# EAGLE design Gateway (EAGLE 9.2.0)
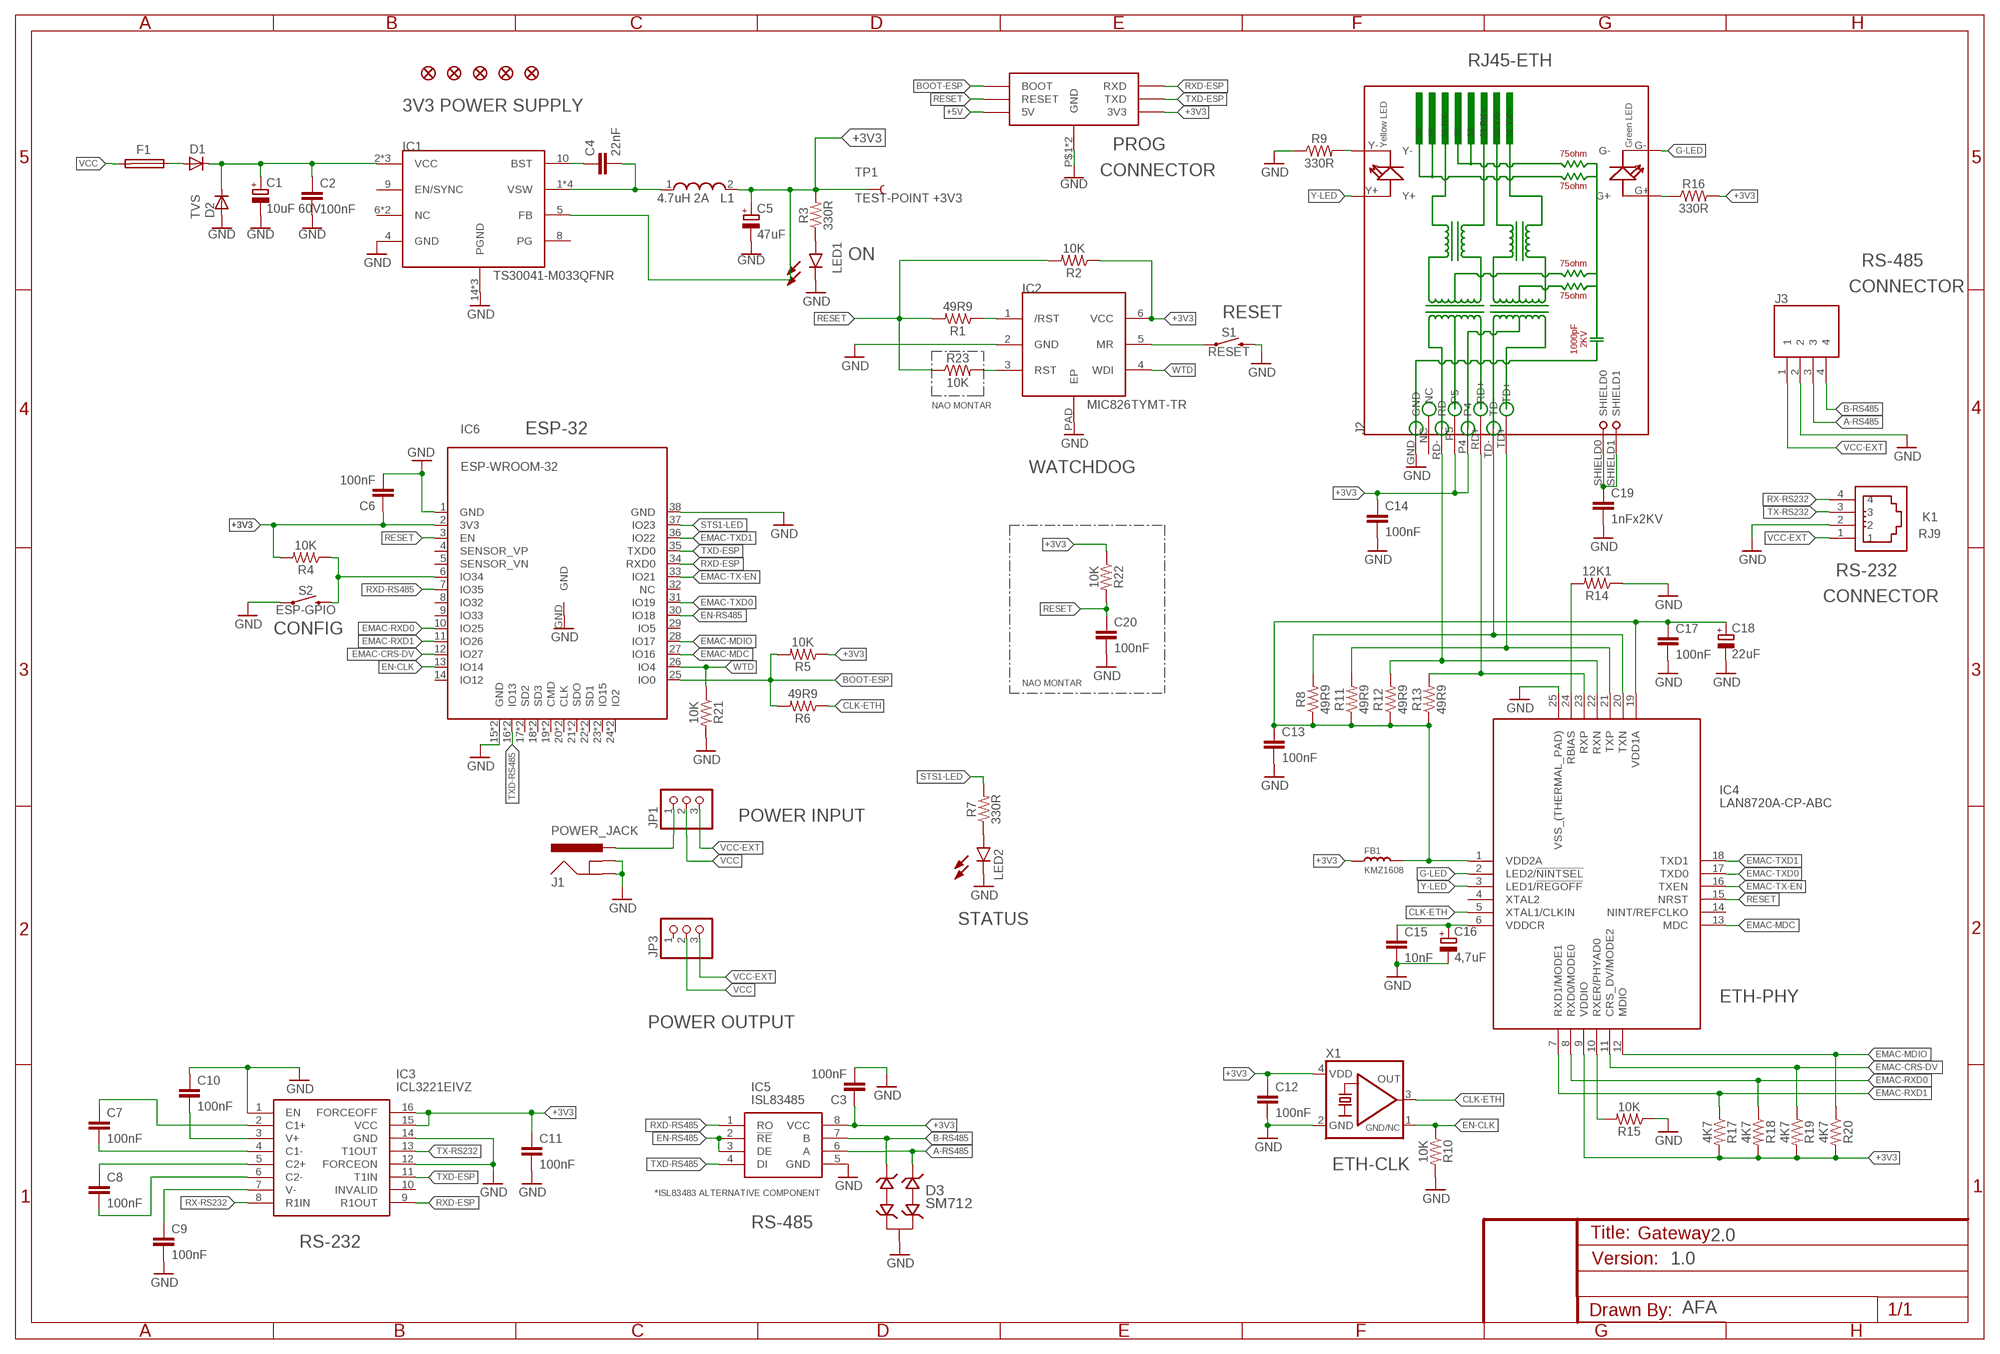
[diagram p0: schematic, sheet 1]
FRAME1 (FRAME-A3): SPICEPREFIX: X

## Parts
C1  10uF 60V  CPOL-EUUD-6,3X7,7  [UD-6,3X7,7_NICHICON]
C2  100nF  1.5PF-0603-50V-16.667%  [0603]
C3  100nF  1.5PF-0603-50V-16.667%  [0603]
C4  22nF  1.5PF-0603-50V-16.667%  [0603]
C5  47uF  CPOL-EUUD-6,3X7,7  [UD-6,3X7,7_NICHICON]
C6  100nF  1.5PF-0603-50V-16.667%  [0603]
C7  100nF  1.5PF-0603-50V-16.667%  [0603]
C8  100nF  1.5PF-0603-50V-16.667%  [0603]
C9  100nF  1.5PF-0603-50V-16.667%  [0603]
C10  100nF  1.5PF-0603-50V-16.667%  [0603]
C11  100nF  1.5PF-0603-50V-16.667%  [0603]
C12  100nF  1.5PF-0603-50V-16.667%  [0603]
C13  100nF  1.5PF-0603-50V-16.667%  [0603]
C14  100nF  1.5PF-0603-50V-16.667%  [0603]
C15  10nF  1.5PF-0603-50V-16.667%  [0603]
C16  4,7uF  CPOL-EUUD-6,3X7,7  [UD-6,3X7,7_NICHICON]
C17  100nF  1.5PF-0603-50V-16.667%  [0603]
C18  22uF  CPOL-EUUD-6,3X7,7  [UD-6,3X7,7_NICHICON]
C19  1nFx2KV  CAP1206  [1206]
C20  100nF  1.5PF-0603-50V-16.667%  [0603]
D1  DIODE-SMB  [SMB]
D2  DIODE-SMB  [SMB]
D3  SM712  CDSOT23-SM712  [SOT-23-3]
F1  FUSE_0679L  [FUSE_0679L]
FB1  KMZ1608  SMD-FERRITE-BEAD-120R-2A(0603)  [L0603]
FD1  FIDUCIAL1X2  [FIDUCIAL-1X2]
FD2  FIDUCIAL1X2  [FIDUCIAL-1X2]
FD3  FIDUCIAL1X2  [FIDUCIAL-1X2]
FD4  FIDUCIAL1X2  [FIDUCIAL-1X2]
FD5  FIDUCIAL1X2  [FIDUCIAL-1X2]
IC1  TS30041-M033QFNR  TS30041-M  [QFN50P300X300X100-17N]
IC2  MIC826TYMT-TR  MIC826RYMT  [DFN-6]
IC3  ICL3221EIVZ  [SOP65P640X120-16N]
IC4  LAN8720A-CP-ABC  [QFN50P400X400X100-25N]
IC5  ISL83485  MAX485CSA+  [SOIC127P600X175-8N]
IC6  ESP-WROOM-32  [ESP-WROOM-32]
J1  POWER_JACK  [POWER_JACK_PTH]
J2  RJ45-HR911105A-HR911105A  [RJ45]
J3  1757268  [SHDR4W120P0X508_1X4_2224X1200X]
JP1  PINHD-1X3  [1X03]
JP3  PINHD-1X3  [1X03]
K1  RJ9  615004143821  [615004143821]
L1  4.7uH 2A  NRS5020T220MMGJ  [INDM4949X200N]
LED1  LTST-S220GKT  [LTST-S220KFKT]
LED2  LTST-S220GKT  [LTST-S220KFKT]
R1  49R9  0.27OHM-0603-1/10W-1%  [0603]
R2  10K  0.27OHM-0603-1/10W-1%  [0603]
R3  330R  0.27OHM-0603-1/10W-1%  [0603]
R4  10K  0.27OHM-0603-1/10W-1%  [0603]
R5  10K  0.27OHM-0603-1/10W-1%  [0603]
R6  49R9  0.27OHM-0603-1/10W-1%  [0603]
R7  330R  0.27OHM-0603-1/10W-1%  [0603]
R8  49R9  0.27OHM-0603-1/10W-1%  [0603]
R9  330R  0.27OHM-0603-1/10W-1%  [0603]
R10  10K  0.27OHM-0603-1/10W-1%  [0603]
R11  49R9  0.27OHM-0603-1/10W-1%  [0603]
R12  49R9  0.27OHM-0603-1/10W-1%  [0603]
R13  49R9  0.27OHM-0603-1/10W-1%  [0603]
R14  12K1  0.27OHM-0603-1/10W-1%  [0603]
R15  10K  0.27OHM-0603-1/10W-1%  [0603]
R16  330R  0.27OHM-0603-1/10W-1%  [0603]
R17  4K7  0.27OHM-0603-1/10W-1%  [0603]
R18  4K7  0.27OHM-0603-1/10W-1%  [0603]
R19  4K7  0.27OHM-0603-1/10W-1%  [0603]
R20  4K7  0.27OHM-0603-1/10W-1%  [0603]
R21  10K  0.27OHM-0603-1/10W-1%  [0603]
R22  10K  0.27OHM-0603-1/10W-1%  [0603]
R23  10K  0.27OHM-0603-1/10W-1%  [0603]
S1  RESET  MOMENTARY-SWITCH-SPST-PTH-RIGHT-ANGLE-KIT  [TACTILE_SWITCH_PTH_RIGHT_ANGLE_KIT]
S2  ESP-GPIO  MOMENTARY-SWITCH-SPST-PTH-RIGHT-ANGLE-KIT  [TACTILE_SWITCH_PTH_RIGHT_ANGLE_KIT]
TP1  TEST-POINT +3V3  TEST-POINT3X5  [PAD.03X.05]
U$4  ESP-PROGESPROG-4  [ESPROG-4]
X1  KXO-TCXO-CMOS-82  [7.0X5.0_KXO-82-TCXO]

## Nets
+3V3: C3.1 C5.+ C6.1 C11.1 C12.1 C14.1 FB1.1 IC1.5(FB) IC2.6(VCC) IC3.15(VCC) IC3.16(FORCEOFF) IC4.9(VDDIO) IC5.8(VCC) IC6.2(3V3) J2.P4 J2.P5 L1.2 R2.1 R3.2 R4.2 R5.1 R16.2 R17.2 R18.2 R19.2 R20.2 R22.1 TP1.P$1 U$4.3V3 X1.4(VDD)
+5V: U$4.5V0(5V)
A-RS485: D3.2(IO2) IC5.6(A) J3.3
B-RS485: D3.1(IO1) IC5.7(B) J3.4
BOOT-ESP: IC6.25(IO0) R5.2 R6.2 U$4.BOOT
CLK-ETH: IC4.5(XTAL1/CLKIN) R6.1 X1.3(OUT)
EMAC-CRS-DV: IC4.11(CRS_DV/MODE2) IC6.12(IO27) R19.1
EMAC-MDC: IC4.13(MDC) IC6.27(IO16)
EMAC-MDIO: IC4.12(MDIO) IC6.28(IO17) R20.1
EMAC-RXD0: IC4.8(RXD0/MODE0) IC6.10(IO25) R18.1
EMAC-RXD1: IC4.7(RXD1/MODE1) IC6.11(IO26) R17.1
EMAC-TX-EN: IC4.16(TXEN) IC6.33(IO21)
EMAC-TXD0: IC4.17(TXD0) IC6.31(IO19)
EMAC-TXD1: IC4.18(TXD1) IC6.36(IO22)
EN-CLK: IC6.13(IO14) R10.1 X1.1(GND/NC)
EN-RS485: IC5.2(!RE) IC5.3(DE) IC6.30(IO18)
G-LED: IC4.2(LED2/!NINTSEL) J2.G-
GND: C1.- C2.2 C3.2 C5.- C6.2 C9.2 C10.1 C11.2 C12.2 C13.2 C14.2 C15.2 C16.- C17.2 C18.- C19.2 C20.2 D2.A D3.3(GND) IC1.4(GND) IC1.14(PGND) IC1.15(PGND) IC1.17(PGND) IC2.2(GND) IC2.PAD(EP) IC3.1(EN) IC3.12(FORCEON) IC3.14(GND) IC4.25(VSS_(THERMAL_PAD)) IC5.5(GND) IC6.1(GND) IC6.15(GND) IC6.38(GND) IC6.39(GND) IC6.GND J1.GND J1.GNDBREAK J2.GND J3.2 K1.2 LED1.2(K) LED2.2(K) R9.1 R10.2 R14.1 R15.1 R21.2 S1.2 S2.1 U$4.P$1(GND) U$4.P$8(GND) X1.2(GND)
N$1: IC2.5(MR) S1.1
N$2: C7.1 IC3.2(C1+)
N$3: C7.2 IC3.4(C1-)
N$4: IC6.6(IO34) R4.1 S2.2
N$5: C8.1 IC3.5(C2+)
N$6: D1.A F1.1
N$7: C8.2 IC3.6(C2-)
N$8: C10.2 IC3.3(V+)
N$9: C9.1 IC3.7(V-)
N$10: J1.PWR JP1.1
N$11: LED1.1(A) R3.1
N$12: C4.1 IC1.10(BST)
N$13: C13.1 C17.1 C18.+ FB1.2 IC4.1(VDD2A) IC4.19(VDD1A) R8.1 R11.1 R12.1 R13.1
N$15: C19.1 J2.SHIELD0 J2.SHIELD1
N$16: IC2.3(RST) R23.2
N$17: IC2.1(/RST) R1.1
N$18: C4.2 IC1.1(VSW) IC1.12(VSW) IC1.13(VSW) IC1.16(VSW) L1.1
N$24: LED2.1(A) R7.1
N$28: J2.G+ R16.1
N$30: IC4.23(RXP) J2.RD+ R13.2
N$31: IC4.22(RXN) J2.RD- R12.2
N$33: IC4.21(TXP) J2.TD+ R11.2
N$34: J2.Y- R9.2
N$35: IC4.20(TXN) J2.TD- R8.2
N$36: C15.1 C16.+ IC4.6(VDDCR)
N$37: IC4.24(RBIAS) R14.2
N$38: IC4.10(RXER/PHYAD0) R15.2
POWER: C1.+ C2.1 D1.C D2.C IC1.2(VCC) IC1.3(VCC) IC1.11(VCC)
RESET: C20.1 IC4.15(NRST) IC6.3(EN) R1.2 R2.2 R22.2 R23.1 U$4.RESET
RX-RS232: IC3.8(R1IN) K1.4
RXD-ESP: IC3.9(R1OUT) IC6.34(RXD0) U$4.RXD
RXD-RS485: IC5.1(RO) IC6.7(IO35)
STS1-LED: IC6.37(IO23) R7.2
TX-RS232: IC3.13(T1OUT) K1.3
TXD-ESP: IC3.11(T1IN) IC6.35(TXD0) U$4.TXD
TXD-RS485: IC5.4(DI) IC6.16(IO13) IC6.40(IO13)
VCC: F1.2 JP1.2 JP3.2
VCC-EXT: J3.1 JP1.3 JP3.3 K1.1
WTD: IC2.4(WDI) IC6.26(IO4) R21.1
Y-LED: IC4.3(LED1/!REGOFF) J2.Y+
Unconnected: IC1.6(NC) IC1.7(NC) IC1.8(PG) IC1.9(EN/SYNC) IC3.10(INVALID) IC4.4(XTAL2) IC4.14(NINT/REFCLKO) IC6.4(SENSOR_VP) IC6.5(SENSOR_VN) IC6.8(IO32) IC6.9(IO33) IC6.14(IO12) IC6.17(SD2) IC6.18(SD3) IC6.19(CMD) IC6.20(CLK) IC6.21(SDO) IC6.22(SD1) IC6.23(IO15) IC6.24(IO2) IC6.29(IO5) IC6.32(NC) IC6.41(SD2) IC6.42(SD3) IC6.43(CMD) IC6.44(IO2) IC6.45(IO15) IC6.46(SD1) IC6.47(SDO) IC6.48(CLK) J2.NC JP3.1

## Notes on the sheet
- RJ45-ETH
- 3V3 POWER SUPPLY
- PROG
- CONNECTOR
- TVS
- ON
- RS-485
- CONNECTOR
- RESET
- NAO MONTAR
- ESP-32
- WATCHDOG
- RS-232
- CONNECTOR
- CONFIG
- NAO MONTAR
- POWER INPUT
- STATUS
- ETH-PHY
- POWER OUTPUT
- ETH-CLK
- *ISL83483 ALTERNATIVE COMPONENT
- RS-485
- 2.0
- RS-232
- 1.0
- AFA

## Library data of the parts
C1 C5 C16 C18 = rcl:CPOL-EU: POLARIZED CAPACITOR, European symbol; SPICEPREFIX: C
C2-C4 C6-C15 C17 C20 = SparkFun-Capacitors:1.5PF: 1.5pF ceramic capacitors A capacitor is a passive two-terminal electrical component used to store electrical energy temporarily in an electric field.; PROD_ID: CAP-08763; VALUE: 1.5pF
C19 = PatternAgents-ProtoPads:CAP: Capacitor Standard 0603 ceramic capacitor, and 0.1" leaded capacitor.
D1 D2 = diode:DIODE-: DIODE
D3 = CDSOT23-SM712:CDSOT23-SM712: Bourns CDSOT23-SM712 http://www.bourns.com/docs/Product-Datasheets/CDSOT23-SM712.pdf TVS Protection Didoe for RS-485 as recommended by TI in their RS-485 Reference Guide: http://www.ti.com/lit/sg/slyt484a/slyt484a.pdf; AVAILABILITY: Good; DESCRIPTION: Diode, Smt Tvs Array, 7vrwm & 12vrwm, Sot23 Package; MF: Bourns; MP: CDSOT23-SM712; PACKAGE: SOT-23 Bourns; PRICE: 0.89 USD
F1 = Fuse_0679L:FUSE_0679L
FB1 = Seeed-OPL-Inductor:SMD-FERRITE-BEAD-120R-2A(0603): 303030024; MPN: BLM18PG121SN1D; VALUE: 120R 2A
FD1-FD5 = SparkFun-Aesthetics:FIDUCIAL: Fiducial Alignment Points Point-of-reference for pick-and-place machines and other optical instruments.
IC1 = IoTMakers:TS30041-M
IC2 = IoTMakers:MIC826RYMT
IC3 = SamacSys:ICL3221EIVZ: Intersil ICL3221EIVZ, Line Transceiver, EIA/TIA-232/ RS-232/ V.24/ V.28, 3.3 V, 5 V, 16-Pin TSSOP Source: Datasheet <http://www.intersil.com/content/dam/Intersil/documents/icl3/icl3221e-22e-23e-32e-41e-43e.pdf>; ARROW_PART_NUMBER: ICL3221EIVZ; ARROW_PRICE-STOCK: https://www.arrow.com/en/products/icl3221eivz/intersil; DESCRIPTION: Intersil ICL3221EIVZ, Line Transceiver, EIA/TIA-232/ RS-232/ V.24/ V.28, 3.3 V, 5 V, 16-Pin TSSOP; HEIGHT: 1.2mm; MANUFACTURER_NAME: Intersil; MANUFACTURER_PART_NUMBER: ICL3221EIVZ; RS_PART_NUMBER: 1708213; RS_PRICE-STOCK: http://uk.rs-online.com/web/p/products/1708213
IC4 = LAN8720A-CP-ABC:LAN8720A-CP-ABC: Ethernet ICs Small Footprint RMII RMII 10/100 Ethernet Source: Datasheet <http://ww1.microchip.com/downloads/en/DeviceDoc/00002165B.pdf>; ARROW_PART_NUMBER: LAN8720A-CP-ABC; ARROW_PRICE/STOCK: https://www.arrow.com/en/products/lan8720a-cp-abc/microchip-technology; DESCRIPTION: Ethernet ICs Small Footprint RMII RMII 10/100 Ethernet; HEIGHT: 1mm; MANUFACTURER_NAME: Microchip; MANUFACTURER_PART_NUMBER: LAN8720A-CP-ABC
IC5 = MAX485CSA+:MAX485CSA+: MAX485CSA+, Line Transceiver, RS-485, RS-422 2.5Mbit/s Differential, 5V, 8-Pin SOIC Source: Datasheet <http://datasheets.maximintegrated.com/en/ds/MAX1487-MAX491.pdf>; ARROW_PART_NUMBER: MAX485CSA+; ARROW_PRICE/STOCK: http://uk.rs-online.com/web/p/products/1659123; DESCRIPTION: MAX485CSA+, Line Transceiver, RS-485, RS-422 2.5Mbit/s Differential, 5V, 8-Pin SOIC; HEIGHT: 1.75mm; MANUFACTURER_NAME: Maxim Integrated; MANUFACTURER_PART_NUMBER: MAX485CSA+; RS_PART_NUMBER: 1659123; RS_PRICE/STOCK: http://uk.rs-online.com/web/p/products/1659123
IC6 = esp32:ESP-WROOM-32
J1 = SparkFun-Connectors:POWER_JACK: Power Jack Connector This is the standard 5.5mm barrel jack for power. The PTH is the most common, proven, reliable, footprint. The Slot footprint only works if the mill layer is transmitted to the PCB fab house so be warned. Here are the connectors we sell at SparkFun: DC Barrel Power Jack/Connector <https://www.sparkfun.com/products/119> (PRT-00119) DC Barrel Power Jack/Connector (SMD) <https://www.sparkfun.com/products/12748> (PRT-12748) DC Barrel Jack Adapter - Breadboard Compatible <https://www.sparkfun.com/products/10811> (PRT-10811) It is used on this SparkFun product (and many, many others): SparkFun RedBoard - Programmed with Arduino <https://www.sparkfun.com/products/12757> (DEV-12757) Also, if you need a mating power supply or connector, please check these out: Wall Adapter Power Supply - 9VDC 650mA <https://www.sparkfun.com/products/298> (TOL-00298) DC Barrel Jack Adapter - Male <https://www.sparkfun.com/products/10287> (PRT-10287); PROD_ID: CONN-08197
J2 = Connector:RJ45-HR911105A
J3 = 1757268:1757268: Pluggable Terminal Blocks 4 Pos 5.08mm pitch Through Hole Header Source: Datasheet <http://uk.rs-online.com/web/p/products/1896127>; ALLIED_NUMBER: 70054631; DESCRIPTION: Pluggable Terminal Blocks 4 Pos 5.08mm pitch Through Hole Header; HEIGHT: 8.6mm; MANUFACTURER_NAME: Phoenix Contact; MANUFACTURER_PART_NUMBER: 1757268; RS_PART_NUMBER: 1896127
JP1 JP3 = pinhead:PINHD-1X3: PIN HEADER
K1 = Wurth_Elektronik_Electromechanic_Input-Output_Connectors_rev15c:615004143821: WR-MJ Horizontal Plastic 4P4C Modular Jack Tab Up, 4 Pins=>Code : Con_I-O_MJ-H_Plastic_Up_615004143821 <http://katalog.we-online.de/media/images/eican/Con_I-O_MJ-H_Plastic_Up_615004143821_pf2.jpg> Details see: http://katalog.we-online.de/en/em/615_004_143_821 Created 2014-07-10, Karrer Zheng 2014 (C) Würth Elektronik
L1 = IoTMakers:NRS5020T220MMGJ: Inductor Power Shielded Wirewound 22uH 20% 100KHz Ferrite 1A 312mOhm DCR T/R; AVAILABILITY: Unavailable; DESCRIPTION: Inductor Power Shielded Wirewound 22uH 20% 100KHz Ferrite 1A 312mOhm DCR T/R; MF: Taiyo Yuden; MP: NRS5020T220MMGJ; PACKAGE: Nonstandard Taiyo Yuden; PRICE: None
LED1 LED2 = LTST-S220GKT:LTST-S220GKT: Lite-On LTST-S220GKT Green LED, 569 nm, 2012 (0805) Side View, Rectangle Lens SMD Package Source: Datasheet <http://www.arrow.com/en/products/ltst-s220gkt/lite-on-electronics>; ARROW_PART_NUMBER: LTST-S220GKT; DESCRIPTION: Lite-On LTST-S220GKT Green LED, 569 nm, 2012 (0805) Side View, Rectangle Lens SMD Package; HEIGHT: mm; MANUFACTURER_NAME: Lite-On; MANUFACTURER_PART_NUMBER: LTST-S220GKT
R1-R23 = SparkFun-Resistors:0.27OHM: 0.27Ω resistor A resistor is a passive two-terminal electrical component that implements electrical resistance as a circuit element. Resistors act to reduce current flow, and, at the same time, act to lower voltage levels within circuits. - Wikipedia; PROD_ID: RES-08787; VALUE: 0.27
S1 S2 = SparkFun-Switches:MOMENTARY-SWITCH-SPST: Momentary Switch (Pushbutton) - SPST Normally-open (NO) SPST momentary switches (buttons, pushbuttons). Variants PTH-12MM - 12mm square, through-hole Momentary Pushbutton Switch - 12mm Square <https://www.sparkfun.com/products/9190> (COM-09190) PTH-6.0MM, PTH-6.0MM-KIT - 6.0mm square, through-hole Mini Pushbutton Switch <https://www.sparkfun.com/products/97> (COM-00097) KIT package intended for soldering kit's - only one side of pads' copper is exposed. PTH-RIGHT-ANGLE-KIT - Right-angle, through-hole Right Angle Tactile Button <https://www.sparkfun.com/products/10791> - Used on SparkFun BigTime Watch Kit <https://www.sparkfun.com/products/11734> SMD-12MM - 12mm square, surface-mount Tactile Button - SMD (12mm) <https://www.sparkfun.com/products/12993> (COM-12993) Used on SparkFun PicoBoard <https://www.sparkfun.com/products/11888> SMD-4.5MM - 4.5mm Square Trackball Switch Used on SparkFun Blackberry Trackballer Breakout <https://www.sparkfun.com/products/13169> SMD-4.6MMX2.8MM - 4.60mm x 2.80mm, surface mount Used on SparkFun SAMD21 Mini Breakout <https://www.sparkfun.com/products/13664> SMD-5.2MM, SMD-5.2-REDUNDANT - 5.2mm square, surface-mount Mini Pushbutton Switch - SMD <https://www.sparkfun.com/products/8720> (COM-08720) Used on Arduino Pro Mini <https://www.sparkfun.com/products/11114> REDUNDANT package connects both switch circuits together SMD-6.0X3.5MM - 6.0 x 3.5mm, surface mount Momentary Reset Switch SMD <https://www.sparkfun.com/products/8229> (COM-08229) SMD-6.2MM-TALL - 6.2mm square, surface mount Tactile Button - SMD (6mm) <https://www.sparkfun.com/products/12992> Used on SparkFun Digital Sandbox <https://www.sparkfun.com/products/12651> SMD-RIGHT-ANGLE - Right-angle, surface mount Used on SparkFun Block for Intel® Edison - Arduino <https://www.sparkfun.com/products/13036>; PROD_ID: CONN-10672; SF_SKU: COM-10791
TP1 = SparkFun-Connectors:TEST-POINT: SparkFun Test Points Bare copper test points for troubleshooting or In-Circuit-Testing. These are used by our Production team for verifying production board runs using pogo-pins on test beds. SparkFun Products: SparkFun LSM9DS1 Breakout <https://www.sparkfun.com/products/13284> SparkFun PSOC <https://www.sparkfun.com/products/13714> SparkFun Load Cell Amplifier <https://www.sparkfun.com/products/13879>
U$4 = IoTMakers:ESP-PROG
X1 = crystal-geyer_V1_0:KXO-TCXO-CMOS: TCXO : CMOS - Serie Model Size l/w/h [mm] Frequency Range Frequency Stability Temp. Range [°C] Output AECQ 200 availabel Datasheet KXO-86 KXO-84 KXO-83 KXO-82 2.5/2.0/0.7 3.2/2.5/1.0 5.0/3.2/1.5 7.0/5.0/2.4 13,0 ~ 40,0 MHz 10,0 ~ 40,0 MHz 10,0 ~ 40,0 MHz 10,0 ~ 30,0 MHz ±1,0 … ±2,5ppm ±1,0 … ±2,5ppm ±1,0 … ±3,0ppm ±1,0 … ±3,0ppm (*) -30°C …+75°C (*) -40°C …+85°C (*) -40°C …+85°C (*) -30°C …+80°C CMOS CMOS CMOS CMOS - - - - KXO-86.pdf <http://www.geyer-electronic.de/uploads/tx_userartikelfrequenz/GEYER-KXO-86-TCXO-HCMOS.pdf> KXO-84.pdf <http://www.geyer-electronic.de/uploads/tx_userartikelfrequenz/GEYER-KXO-84-TCXO-HCMOS.pdf> KXO-83.pdf <http://www.geyer-electronic.de/uploads/tx_userartikelfrequenz/GEYER-KXO-83-TCXO-HCMOS.pdf> KXO-82.pdf <http://www.geyer-electronic.de/uploads/tx_userartikelfrequenz/GEYER-KXO-82-TCXO-HCMOS.pdf> <http://www.geyer-electronic.de/fileadmin/template/img/logo-geyer-electronic.png> Details see: http://www.geyer-electronic.de/Frequenz-Produkte.9.0.html Created 2016-06-07, Hans Locher 2016 (C) Geyer Quartz Technology KXO86,KXO84,KXO83,KXO82;2550;3225;5032;7050;2,5x2,0;3,2x2,5;2.5x2.0;3.2x2.5,5,0x3,2;7,0x5,0,5.0x3.2,7.0x5.0

## Net classes
0 default: clearance 0.205 mm

## Board
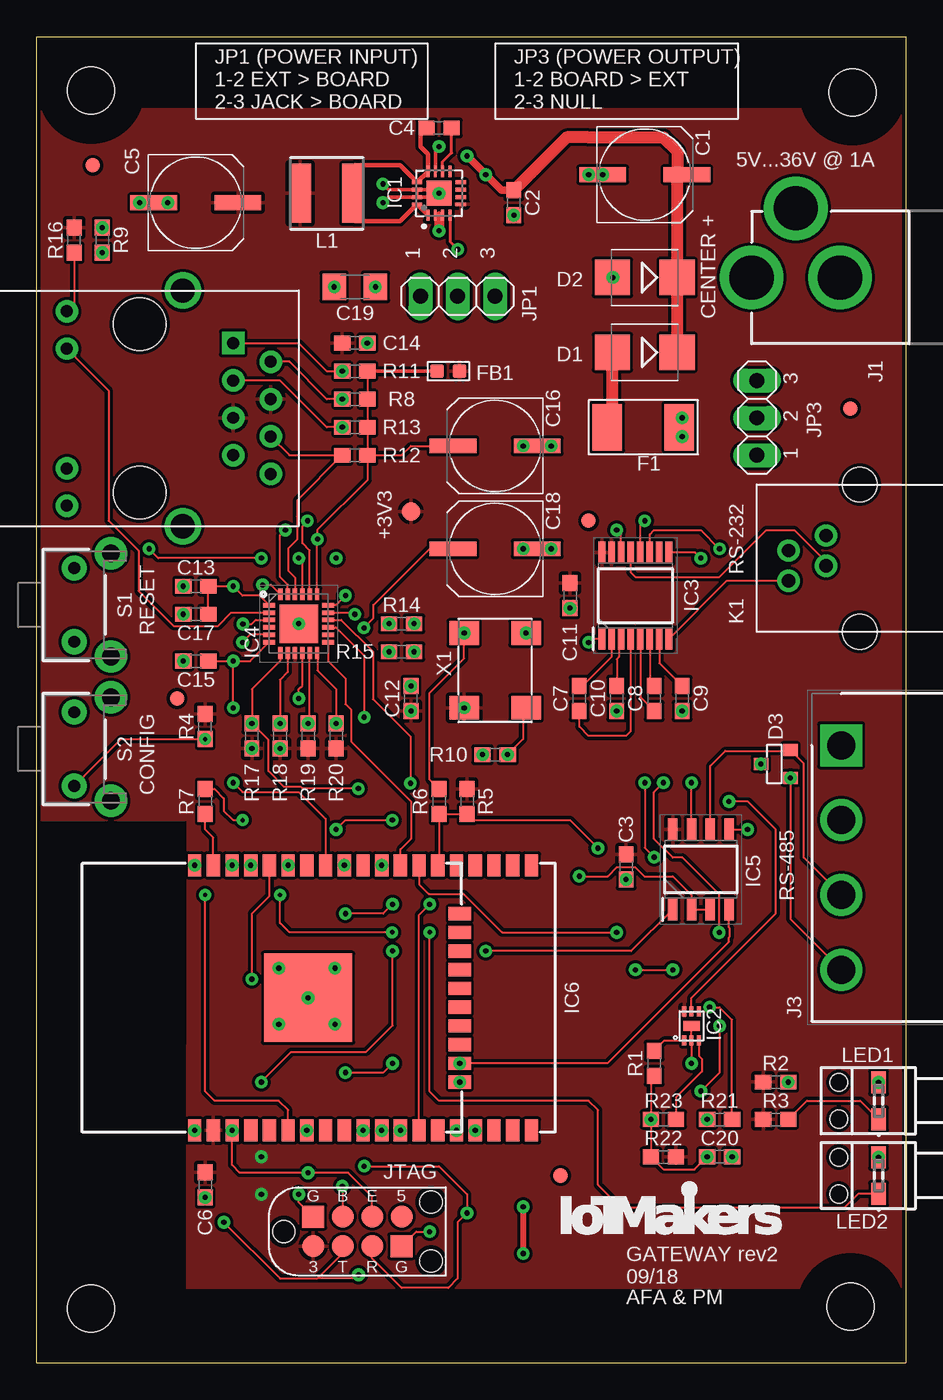
[diagram p1: board, top side]
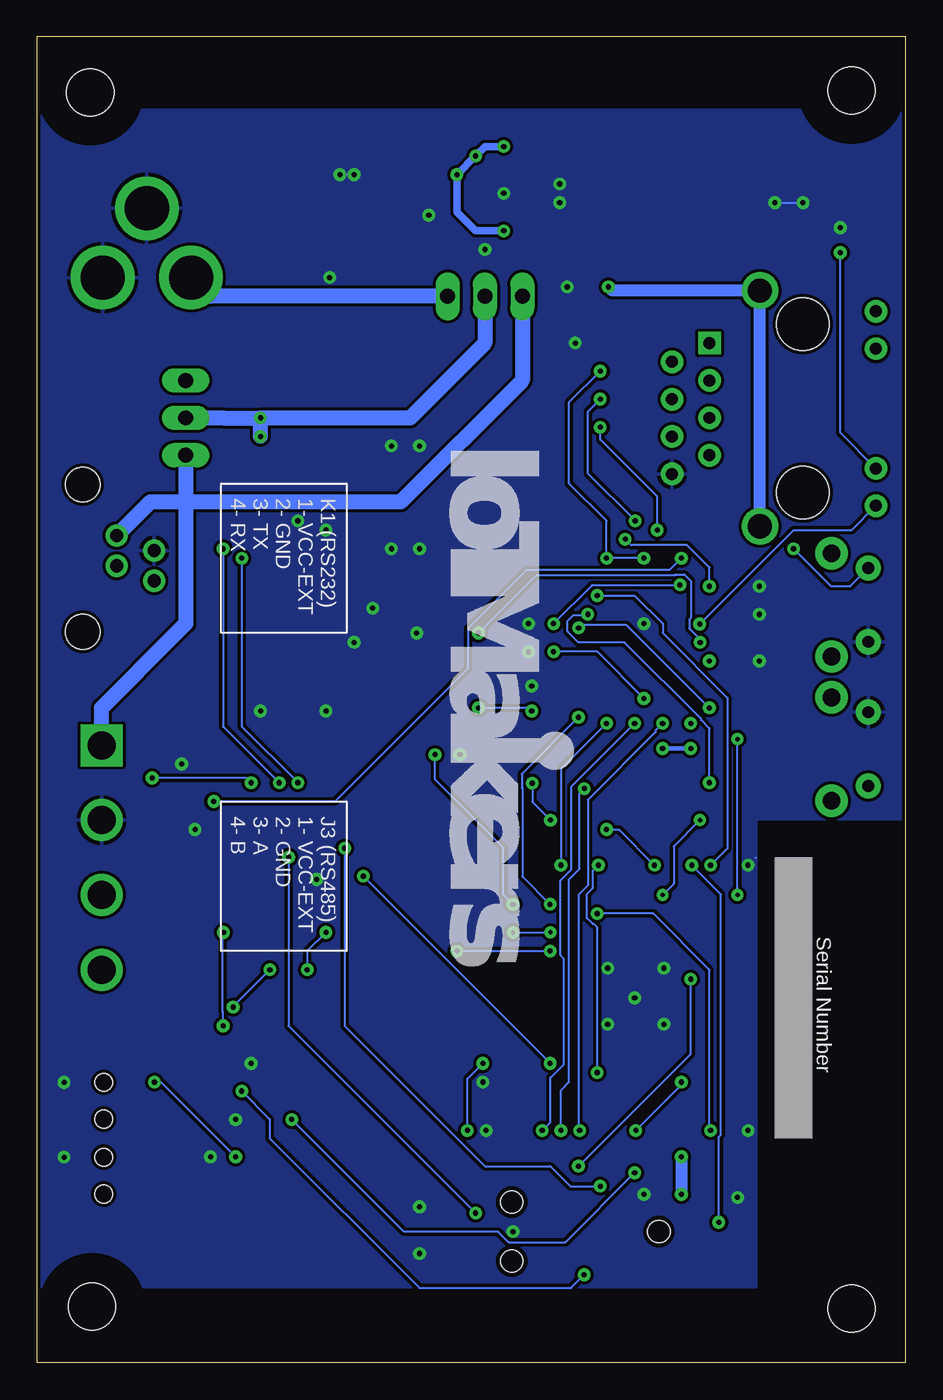
[diagram p2: board, bottom side, seen from below]

Size 59 x 90 mm. Coordinates in mm from the lower left corner, seen from the top.
Outline: 0,0 59,0 59,90 0,90 0,0
Copper layers (1*16): Top 0.035mm / dielectric 1.5mm / Bottom 0.035mm
Design rules "PCBWay": minimum track width 6mil, minimum drill 0.3mm, track to track 6mil, track to pad 6mil, pad to pad 6mil, via to via 6mil, smd to smd 6mil, copper to edge 10mil, drill to drill 6mil, minimum pad ring 12mil, minimum via ring 10mil, stop-mask expansion 4mil, vias tented up to drill 25mil, thermal gap 10mil

### Footprints (pad centres in the part's own frame; a part is rotated, then mirrored left to right if it is on the bottom)
UD-6,3X7,7_NICHICON = smd 3.181 x 1: + 2.858,0; - -2.858,0
0603 = smd 1.1 x 1: 1 -0.85,0; 2 0.85,0
1206 = smd 1.6 x 1.8: 1 -1.4,0; 2 1.4,0
SMB = smd 2.4 x 2.4: A 2.2,0; C -2.2,0
SOT-23-3 = smd 0.802 x 0.972: 1 -0.95,-1; 2 0.95,-1; 3 0,1
FUSE_0679L = smd 2 x 3.15: 1 0,0; 2 4.88,0
L0603 = smd 0.889 x 0.889: 1 -0.762,0; 2 0.762,0
FIDUCIAL-1X2 = smd 1 x 1: 1 0,0
QFN50P300X300X100-17N = smd 0.76 x 0.26: 1 -1.485,0.75; 2 -1.485,0.25; 3 -1.485,-0.25; 4 -1.485,-0.75; 9 1.485,-0.75; 10 1.485,-0.25; 11 1.485,0.25; 12 1.485,0.75 | smd 0.26 x 0.76: 5 -0.75,-1.485; 6 -0.25,-1.485; 7 0.25,-1.485; 8 0.75,-1.485; 13 0.75,1.485; 14 0.25,1.485; 15 -0.25,1.485; 16 -0.75,1.485 | smd 1.7 x 1.7: 17 0,0
DFN-6 = smd 0.28 x 0.7: 1 -0.5,-0.988; 2 0,-0.988; 3 0.5,-0.988; 4 0.5,0.988; 5 0,0.988; 6 -0.5,0.988 | smd 1.1 x 0.7: PAD 0,0
SOP65P640X120-16N = smd 1.475 x 0.446: 1 -2.938,2.275; 2 -2.938,1.625; 3 -2.938,0.975; 4 -2.938,0.325; 5 -2.938,-0.325; 6 -2.938,-0.975; 7 -2.938,-1.625; 8 -2.938,-2.275; 9 2.938,-2.275; 10 2.938,-1.625; 11 2.938,-0.975; 12 2.938,-0.325; 13 2.938,0.325; 14 2.938,0.975; 15 2.938,1.625; 16 2.938,2.275
QFN50P400X400X100-25N = smd 0.8 x 0.3: 1 -2,1.25; 2 -2,0.75; 3 -2,0.25; 4 -2,-0.25; 5 -2,-0.75; 6 -2,-1.25; 13 2,-1.25; 14 2,-0.75; 15 2,-0.25; 16 2,0.25; 17 2,0.75; 18 2,1.25 | smd 0.3 x 0.8: 7 -1.25,-2; 8 -0.75,-2; 9 -0.25,-2; 10 0.25,-2; 11 0.75,-2; 12 1.25,-2; 19 1.25,2; 20 0.75,2; 21 0.25,2; 22 -0.25,2; 23 -0.75,2; 24 -1.25,2 | smd 2.6 x 2.6: 25 0,0
SOIC127P600X175-8N = smd 1.525 x 0.65: 1 -2.712,1.905; 2 -2.712,0.635; 3 -2.712,-0.635; 4 -2.712,-1.905; 5 2.712,-1.905; 6 2.712,-0.635; 7 2.712,0.635; 8 2.712,1.905
ESP-WROOM-32 = smd 0.9 x 1.5: 1 7.7,9; 2 6.43,9; 3 5.16,9; 4 3.89,9; 5 2.62,9; 6 1.35,9; 7 0.08,9; 8 -1.19,9; 9 -2.46,9; 10 -3.73,9; 11 -5,9; 12 -6.27,9; 13 -7.54,9; 14 -8.81,9; 25 -8.81,-9; 26 -7.54,-9; 27 -6.27,-9; 28 -5,-9; 29 -3.73,-9; 30 -2.46,-9; 31 -1.19,-9; 32 0.08,-9; 33 1.35,-9; 34 2.62,-9; 35 3.89,-9; 36 5.16,-9; 37 6.43,-9; 38 7.7,-9; 39 -10.08,9; 40 -11.35,9; 41 -12.62,9; 42 -13.89,9; 43 -15.16,9; 44 -10.08,-9; 45 -11.35,-9; 46 -12.62,-9; 47 -13.89,-9; 48 -15.16,-9 | smd 1.5 x 0.9: 15 -10.3,5.715; 16 -10.3,4.445; 17 -10.3,3.175; 18 -10.3,1.905; 19 -10.3,0.635; 20 -10.3,-0.635; 21 -10.3,-1.905; 22 -10.3,-3.175; 23 -10.3,-4.445; 24 -10.3,-5.715 | smd 6 x 6: GND 0,0
POWER_JACK_PTH = drill 2.997 pad 4.318: GND 0,7.7; GNDBREAK 4.7,10.7; PWR 0,13.7
RJ45 = drill 0.813 pad 1.524: G+ 4.953,-6.604; G- 4.953,-4.064; GND -8.89,4.445; NC -6.35,3.175; P4 -8.89,-0.635; P5 -6.35,0.635; RD+ -6.35,-1.905; RD- -8.89,1.905; TD- -8.89,-3.175; Y+ 4.953,6.604; Y- 4.953,4.064 | drill 1.651 pad 2.159: SHIELD0 -2.921,8.001; SHIELD1 -2.921,-8.001 | drill 0.813 pad 1.524 square: TD+ -6.35,-4.445 | hole 3.556: 0,-5.715; 0,5.715
SHDR4W120P0X508_1X4_2224X1200X = drill 1.9 pad 2.85 square: 1 0,0 | drill 1.9 pad 2.85: 2 5.08,0; 3 10.16,0; 4 15.24,0
1X03 = drill 1.016 long: 1 -2.54,0; 2 0,0; 3 2.54,0
615004143821 = drill 0.9: 1 1.53,2.3; 2 0.51,4.84; 3 -0.51,2.3; 4 -1.53,4.84 | hole 2.36: -5,0; 5,0
INDM4949X200N = smd 1.5 x 4: 1 -1.8,0; 2 1.8,0
LTST-S220KFKT = smd 1 x 1.5: 1 0,1.25; 2 0,-1.25
TACTILE_SWITCH_PTH_RIGHT_ANGLE_KIT = drill 0.8 pad 1.7: 1 -2.5,0; 2 2.5,0 | drill 1.2 pad 2.2: ANCHOR1 -3.5,2.5; ANCHOR2 3.5,2.5
PAD.03X.05 = smd 1.27 x 1.27: P$1 0,0
HOLE-3.2/7.0 = hole 3.2: 0,0
ESPROG-4 = smd 1.5 x 1.5: 3V3 2,-2; 5V0 8,0; BOOT 4,0; P$1 2,0; P$8 8,-2; RESET 6,0; RXD 6,-2; TXD 4,-2 | hole 1.5: 10,1; 10,-3; 0,-1
BIVAR_SLP3-350-100-F = hole 1.2: -1.25,2.7; 1.25,2.7
7.0X5.0_KXO-82-TCXO = smd 1.6 x 2: 1 -2.54,-2.1; 2 2.54,-2.1; 3 2.54,2.1; 4 -2.54,2.1

### Placement (x,y rotation side)
C1  41.27,80.64 0 top
C2  32.38,78.74 270 top
C3  40.01,33.66 270 top
C4  27.3,83.82 180 top
C5  10.79,78.74 0 top
C6  11.43,12.06 270 top
C7  36.83,45.09 270 top
C8  41.91,45.09 90 top
C9  43.81,45.09 270 top
C10  39.37,45.09 90 top
C11  36.2,52.07 270 top
C12  25.4,45.09 90 top
C13  10.79,52.7 180 top
C14  21.59,69.22 0 top
C15  10.79,47.62 180 top
C16  31.11,55.24 180 top
C17  10.79,50.8 180 top
C18  31.11,62.23 180 top
C19  21.59,73.03 0 top
C20  46.35,13.97 0 top
D1  41.27,68.58 180 top
D2  41.27,73.66 180 top
D3  50.16,40.64 90 top
F1  38.73,63.5 0 top
FB1  27.94,67.31 180 top
FD1  3.81,81.28 0 top
FD2  37.47,57.15 0 top
FD3  55.24,64.77 0 top
FD4  35.56,12.7 0 top
FD5  9.53,45.09 0 top
IC1  27.3,79.38 90 top
IC2  44.45,22.86 0 top
IC3  40.64,52.07 90 top
IC4  17.78,50.16 0 top
IC5  45.09,33.48 90 top
IC6  18.41,24.77 180 top
J1  62.23,73.66 90 top
J2  6.99,64.77 180 top
J3  54.61,41.91 270 top
JP1  28.57,72.39 180 top
JP3  48.9,64.14 270 top
K1  55.88,54.61 90 top
L1  19.68,79.38 180 top
LED1  57.15,17.78 180 top
LED2  57.15,12.7 180 top
R1  41.91,20.32 270 top
R2  50.16,19.05 0 top
R3  50.16,16.51 180 top
R4  11.43,43.18 90 top
R5  29.21,38.1 270 top
R6  27.3,38.1 270 top
R7  11.43,38.1 270 top
R8  21.59,65.41 180 top
R9  4.45,76.2 270 top
R10  31.11,41.27 180 top
R11  21.59,67.31 180 top
R12  21.59,61.59 180 top
R13  21.59,63.5 180 top
R14  24.77,50.16 180 top
R15  24.77,48.26 180 top
R16  2.54,76.2 90 top
R17  14.61,42.55 270 top
R18  16.51,42.55 270 top
R19  18.41,42.55 270 top
R20  20.32,42.55 270 top
R21  46.35,16.51 180 top
R22  42.55,13.97 180 top
R23  42.55,16.51 0 top
S1  2.54,51.44 270 top
S2  2.54,41.66 270 top
TP1  25.4,57.78 0 top
U$1  [LOGO_L]  35.43,8.64 0 top
U$2  [HOLE-3.2/7.0]  55.24,3.81 0 top
U$3  [LOGO_XL]  31.11,62.23 270 bottom
U$4  16.76,9.91 0 top
U$5  [BIVAR_SLP3-350-100-F]  57.15,17.78 90 top
U$6  [HOLE-3.2/7.0]  3.68,86.36 0 top
U$7  [BIVAR_SLP3-350-100-F]  57.15,12.7 90 top
U$8  [HOLE-3.2/7.0]  3.68,3.68 0 top
U$9  [HOLE-3.2/7.0]  55.37,86.23 0 bottom
X1  31.11,46.99 90 top

### Tracks (layer width: path | path; a pad name or v marks a point on that pad's centre or on a via)
+3V3  (via drill 0.35)
  Bottom 0.152: C12.1 25.61,44.45 v29.02,44.45
  Bottom 0.305: R17.2 R18.2
  Bottom 0.813: v15.24,13.97 v15.24,11.43
  other vias: 25.4,44.23 14.61,41.7 16.51,41.7
  pour Top: 10.16,5.08 60.96,5.08 60.96,85.09 -1.27,85.09 -1.27,36.83 10.2,36.83 10.16,6.35
A-RS485
  Top 0.152: IC5.6 45.72,40.51 46.74,41.53 51.1,41.53 D3.2 52.07,40.69 52.07,34.29 J3.3
B-RS485  (via drill 0.35)
  Top 0.152: IC5.7 v44.45,39.37 | D3.1 51.16,30.11 J3.4
  Bottom 0.152: v44.45,39.37 44.77,39.69 D3.1
  other vias: 51.16,39.69
BOOT-ESP  (via drill 0.35)
  Top 0.152: IC6.25 27.3,33.84 R6.2 R5.2 29.63,36.83 36.2,36.83 v38.1,34.92 | v20.74,11.98 20.74,9.93 U$4.BOOT
  Bottom 0.152: v38.1,34.92 38.1,22.86 28.57,13.34 24.13,13.34 22.78,11.98 v20.74,11.98
CLK-ETH  (via drill 0.35)
  Top 0.152: v29.02,49.53 29.02,47.81 26.67,45.47 26.67,39.59 R6.1 | IC4.5 14.49,49.41 v13.97,48.9
  Bottom 0.152: v13.97,48.9 13.97,49.12 14.7,49.85 14.7,50.44 14.61,50.53 14.61,53.07 15.04,53.51 15.62,53.51 15.68,53.45 25.09,53.45 v29.02,49.53
EMAC-CRS-DV  (via drill 0.35)
  Top 0.152: R19.1 18.53,43.51 IC4.11
  Bottom 0.152: IC6.12 24.13,16.32 24.13,19.34 23.22,20.25 23.22,27.42 23.44,27.65 23.44,31.11 23.44,31.41 23.44,32.73 22.7,33.47 22.7,39.1 R19.1
  other vias: 18.41,43.4 24.68,15.77
EMAC-MDC
  Top 0.152: IC6.27 24.68,34.84 25.4,35.56 25.4,38.1 21.34,42.16 21.34,44.32 20.95,44.7 20.95,46.45 19.78,47.62 IC4.13
EMAC-MDIO  (via drill 0.35)
  Top 0.152: IC4.12 19.05,48.15 19.05,46.99 20.32,45.72 R20.1
  Bottom 0.152: R20.1 23.41,40.3 IC6.28
  other vias: 23.41,33.77 20.32,43.4
EMAC-RXD0  (via drill 0.35)
  Top 0.152: IC4.8 17.03,46.88 16.51,46.35 R18.1
  Bottom 0.152: R18.1 16.99,42.91 16.99,42.8 21.59,38.2 21.59,32.38 22.23,31.75 22.23,15.85 IC6.10
  other vias: 16.51,43.4 22.14,15.77
EMAC-RXD1  (via drill 0.35)
  Top 0.152: IC4.7 16.53,47.65 14.61,45.72 R17.1 15.73,42.27 15.73,40.15 16.79,39.09 17.93,39.09 18.05,38.97 v21.83,38.97
  Bottom 0.152: IC6.11 23.41,18.5 22.86,19.05 22.86,32.81 22.14,33.53 22.14,38.66 v21.83,38.97
  other vias: 14.61,43.4 23.41,15.77
EMAC-TX-EN  (via drill 0.35)
  Top 0.152: v25.36,39.33 25.36,42.51 22.82,45.05 22.82,48.26 20.67,50.41 IC4.16 | v20.32,36.2 20.95,36.83 v24.13,36.83
  Bottom 0.152: v20.32,36.2 19.5,36.2 v17.07,33.77 | v24.13,36.83 25.36,38.06 v25.36,39.33
EMAC-TXD0  (via drill 0.35)
  Top 0.152: v13.34,39.37 13.97,38.73 17.78,38.73 19.61,36.91 IC6.31 | IC4.17 21.48,50.91 v21.59,50.8
  Bottom 0.152: v13.34,39.37 13.34,43.05 13.89,43.62 13.89,43.69 19.1,48.9 22.23,48.9 22.96,49.63 22.96,50.36 22.58,50.74 21.65,50.74 v21.59,50.8
EMAC-TXD1  (via drill 0.35)
  Top 0.152: IC4.18 20.3,51.41 v20.95,52.07
  Bottom 0.152: v20.95,52.07 18.41,52.07 16.51,50.16 16.51,49.53 12.12,45.13 12.12,34.91 v13.26,33.77
EN-CLK  (via drill 0.35)
  Top 0.152: X1.1 33.02,44.26 33.02,42.33 R10.1 | IC6.13 25.95,30.4 v26.67,31.11
  Bottom 0.152: v26.67,31.11 27.3,31.75 27.3,34.92 31.96,39.59 R10.1
  other vias: 31.96,41.27
EN-RS485  (via drill 0.35)
  Top 0.152: IC5.3 IC5.2 44.45,31.75 43.18,33.02 41.24,33.02 40.62,33.64 39.39,33.64 38.77,33.02 v36.83,33.02 | v24.15,20.32 23.52,19.68 v20.95,19.68
  Bottom 0.152: v36.83,33.02 24.15,20.34 v24.15,20.32 | v20.95,19.68 20.95,29.55 21.18,29.77 21.25,29.77 21.66,30.19 21.66,31.8 21.23,32.24 21.23,33.41 IC6.30
  other vias: 20.88,33.77
G-LED
  Top 0.152: J2.G- 4.88,65.99 4.88,57.15 6.91,55.12 6.91,52.39 9.28,50.02 12.31,50.02 13.21,50.91 IC4.2
GND  (via drill 0.35)
  Top 0.152: v33.02,55.24 C16.- v34.92,55.24 | IC3.14 39.66,56.22 v39.37,56.52 | IC3.12 40.97,56.84 v41.27,57.15 | IC3.1 37.7,49.13 v37.47,48.9 | IC5.5 v48.26,36.2 | IC2.PAD IC2.2 v44.45,20.32 | D2.A v39.12,73.66 | C5.- v8.89,78.74 | v33.02,62.23 C18.- v34.92,62.23 | U$4.P$8 25.75,8.89 v26.67,8.89 | U$4.P$1 17.78,10.89 v17.78,11.43
  Top 0.203: IC1.4 28.05,76.08 v28.57,75.56
  Top 0.254: IC1.14 IC1.15 | IC1.15 23.88,79.12 v23.5,78.74 | IC1.14 23.88,79.62 v23.5,80.01 | IC1.14 27.05,79.62 IC1.17 27.05,79.12 IC1.15
  Top 0.406: v33.02,10.58 v33.02,7.41
  Bottom 0.152: v37.47,80.64 C1.- | v8.89,78.74 v6.99,78.74 | 10.19,34.29 10.16,34.29
  other vias: 9.95,52.7 9.95,50.8 17.78,50.16 10.71,33.77 16.43,26.78 20.24,26.78 20.24,22.97 16.43,22.97 28.71,19.05 28.5,15.77 10.71,15.77 4.45,77.05 25.61,48.26 9.95,47.62 33.22,49.53 27.3,79.38 32.38,77.89 11.43,11.21 49.16,40.64 22.44,69.22 43.81,44.23 36.2,51.22 40.01,32.8 25.4,45.94 30.27,41.27 25.61,50.16 39.37,44.23 57.15,19.03 57.15,13.95 38.42,80.64 18.41,24.77 22.99,73.03 45.51,16.51 47.2,13.97
  pour Bottom: 10.16,5.08 60.96,5.08 60.96,85.09 -1.27,85.09 -1.27,36.83 8.89,36.83 10.16,36.83 10.16,6.35
N$1  (via drill 0.35)
  Top 0.152: IC2.5 44.45,24.77 50.16,30.48 50.16,36.2 48.26,38.1 v46.99,38.1 | v15.24,54.61 8.26,54.61 v7.62,55.24
  Bottom 0.152: v46.99,38.1 38.73,38.1 29.73,47.11 29.73,49.82 25.74,53.81 16.04,53.81 v15.24,54.61 | v7.62,55.24 5.08,52.7 3.77,52.7 S1.1
N$2
  Top 0.152: C7.1 37.05,45.94 39.02,47.91 IC3.2
N$3
  Top 0.152: C7.2 36.83,43.18 37.47,42.55 40.01,42.55 40.31,42.85 IC3.4
N$4  (via drill 0.3)
  Top 0.152: S2.2 5.71,42.33 R4.1 | IC6.6 17.07,17.14 16.43,17.78 12.06,17.78 11.43,18.41 v11.43,31.75
  Bottom 0.152: v11.43,31.75 R4.1
  other vias: 11.43,42.33
N$5
  Top 0.152: C8.1 40.97,45.18 IC3.5
N$6
  Top 0.813: F1.1 39.08,63.84 D1.A
N$7
  Top 0.152: IC3.6 41.62,46.23 C8.2
N$8
  Top 0.152: C10.2 39.37,47.76 39.52,47.9 39.52,48.99 IC3.3
N$9
  Top 0.152: C9.1 42.27,47.48 IC3.7
N$10
  Bottom 1.016: JP1.1 47.26,72.39 J1.PWR
N$11
  Top 0.152: R3.1 52.28,17.78 55.9,17.78 LED1.1
N$12
  Top 0.203: IC1.10 27.55,81.53 28.16,82.13 C4.1
N$13  (via drill 0.35)
  Top 0.152: C18.+ 25.4,62.23 24.77,61.59 R12.1 | R11.1 R8.1 R13.1 R12.1 | C17.1 C13.1 v13.34,52.7 13.97,52.07 15.12,52.07 IC4.1 | IC4.19 19.03,55.88 v19.04,55.89 | v19.04,55.89 v19.05,55.9 | R12.1 22.44,59.91 19.04,56.51 v19.04,55.89
  Top 0.254: R11.1 FB1.2
  Bottom 0.152: v13.34,52.7 13.34,53.98 14.86,55.5 18.65,55.5 v19.05,55.9
N$15  (via drill 0.35)
  Bottom 0.813: J2.SHIELD0 J2.SHIELD1 19.94,72.77 C19.1
  other vias: 20.19,73.03
N$16
  Top 0.152: R23.2 43.4,18 45.16,19.76 45.16,20.61 44.95,20.82 IC2.3
N$17
  Top 0.152: R1.1 42.61,21.87 IC2.1
N$18
  Top 0.254: 21.48,80.01 L1.1
  Top 0.305: C4.2 26.04,83.4 26.04,82.55 26.55,82.03 IC1.12 IC1.13 24.66,81.28 21.59,81.28 21.59,80.11 21.48,80.01 | L1.1 21.59,79.27 21.59,77.47 24.66,77.47 IC1.16 IC1.1
N$24  (via drill 0.3)
  Top 0.152: v26.67,29.21 26.67,18.41 27.3,17.78 37.47,17.78 38.1,17.14 38.1,12.09 39.66,10.52 54.84,10.52 55.77,11.45 LED2.1 | v24.13,29.21 17.14,29.21 16.51,29.84 v16.51,31.75 | R7.1 12.06,38.95 12.7,38.31 12.7,37.47 13.34,36.83 v13.97,36.83
  Bottom 0.152: v26.67,29.21 v24.13,29.21 | v13.97,36.83 15.75,35.05 15.75,32.51 v16.51,31.75
N$28
  Top 0.152: R16.1 2.54,71.88 J2.G+
N$30  (via drill 0.35)
  Top 0.152: R13.2 19.68,63.5 16.51,66.67 J2.RD+ | IC4.23 17.03,52.82 16.51,53.34 16.51,56.15 v16.87,56.52
  Bottom 0.152: v16.87,56.52 16.87,58.78 20.74,62.65 R13.2
  other vias: 20.74,63.5
N$31
  Top 0.152: IC4.22 17.53,53.3 17.07,53.76 17.07,55.28 17.67,55.88 17.67,56.85 17.66,56.86 17.66,57.44 17.67,57.45 17.67,58.53 R12.2 17.14,61.59 J2.RD-
N$33  (via drill 0.35)
  Top 0.152: IC4.21 18.03,54.36 v17.78,54.61 | J2.TD+ 17.78,69.22 19.68,67.31 R11.2
  Bottom 0.152: v17.78,54.61 v20.32,54.61 20.32,57.15 22.86,59.69 22.86,65.19 R11.2
  other vias: 20.74,67.31
N$34  (via drill 0.35)
  Bottom 0.152: J2.Y- 4.45,63.12 R9.2
  other vias: 4.45,75.35
N$35  (via drill 0.35)
  Top 0.152: v18.37,57.15 18.39,57.13 18.03,56.77 18.03,55.63 18.53,55.13 IC4.20 | R8.2 19.68,65.41 17.14,67.94 J2.TD-
  Bottom 0.152: v18.37,57.15 21.59,60.37 21.59,64.56 R8.2
  other vias: 20.74,65.41
N$36  (via drill 0.35)
  Top 0.152: C15.1 v13.34,47.62 | v13.34,47.62 14.49,47.62 IC4.6 | C16.+ 27.94,55.24 27.46,55.24 26.67,55.24 22.86,51.44 22.86,50.53 v22.21,49.88 | v13.34,44.45 v13.34,47.62
  Bottom 0.152: v13.34,44.45 18.97,50.09 22,50.09 v22.21,49.88
N$37  (via drill 0.35)
  Top 0.152: v15.33,52.8 15.9,52.8 IC4.24
  Bottom 0.152: R14.2 21.29,52.8 v15.33,52.8
  other vias: 23.91,50.16
N$38  (via drill 0.35)
  Top 0.152: v17.78,45.09 17.78,45.72 18.03,45.97 IC4.10
  Bottom 0.152: v17.78,45.09 20.95,48.26 R15.2
  other vias: 23.91,48.26
POWER  (via drill 0.35)
  Top 0.152: IC1.2 27.3,77.89 IC1.3
  Top 0.203: IC1.2 27.05,77.08 v27.3,76.83 27.55,77.08 IC1.3
  Top 0.254: IC1.11 27.05,82.3 v27.3,82.55
  Top 0.508: C2.1 31.54,79.59 v30.48,80.64 v29.21,81.92 | 27.3,77.89 v27.3,76.83
  Top 0.813: D1.C D2.C 43.48,80.94 | 43.48,80.94 43.48,82.25 42.55,83.19 37.47,83.19 35.98,83.19 C2.1 | 43.48,80.94 43.18,80.64 C1.+
  Bottom 0.508: v27.3,82.55 28.57,82.55 v29.21,81.92 | v29.21,81.92 v30.48,80.64 | v30.48,80.64 30.48,78.11 29.21,76.83 v27.3,76.83 | v29.21,81.92 v30.48,80.64
RESET  (via drill 0.35)
  Top 0.152: U$4.RESET 22.76,11.27 21.14,12.89 v18.41,12.89 13.78,12.89 13.26,13.41 v13.26,15.77 | R1.2 41.7,19.25 R23.1 R22.2 42.55,13.12 44.66,13.12 v45.51,13.97 | v22.23,43.81 22.23,48.01 20.32,49.91 IC4.15 | v24.15,31.11 23.52,30.48 v20.95,30.48
  Bottom 0.152: v45.51,13.97 50.59,19.05 R2.2 | v18.41,12.89 23.13,8.18 26.96,8.18 27.67,8.89 34.08,8.89 R23.1 | v22.23,43.81 26.07,39.97 26.07,39.04 26.04,39 26.04,33 v24.15,31.11 | v13.26,15.77 13.34,15.85 13.34,26.67 17.14,30.48 v20.95,30.48
  other vias: 51.02,19.05 41.7,16.51
RX-RS232
  Top 0.152: K1.4 46.99,53.08 46.86,53.08 IC3.8
RXD-ESP  (via drill 0.35)
  Top 0.152: v14.61,26.04 14.61,30.48 15.79,31.67 IC6.34 | v41.27,39.37 41.27,34.95 v41.91,34.31 | U$4.RXD 22.76,7.08 24.77,5.08 27.94,5.08 28.57,5.71 28.57,9.53 v29.21,10.16 29.21,11.43 27.3,13.34 v22.23,13.34 | v45.09,54.61 44.69,55.01 IC3.9
  Bottom 0.152: v22.23,13.34 14.61,20.95 v14.61,26.04 | v45.09,54.61 45.09,43.18 v41.27,39.37 | v41.91,34.31 41.91,22.86 v29.21,10.16
RXD-RS485  (via drill 0.35)
  Top 0.152: IC5.1 40.35,27.94 v30.48,27.94 | v15.24,19.05 17.27,21.08 22.35,21.08 24.15,22.88 v24.15,27.94
  Bottom 0.152: v30.48,27.94 v24.15,27.94 | IC6.7 15.24,18.86 v15.24,19.05
  other vias: 18.34,15.77
STS1-LED
  Top 0.152: IC6.37 11.98,35.64 11.43,36.2 R7.2
TX-RS232
  Top 0.152: K1.3 53.58,54.37 51.44,56.52 49.53,56.52 46.35,53.34 40.64,53.34 40.31,53.66 IC3.13
TXD-ESP  (via drill 0.35)
  Top 0.152: 19.05,5.71 16.51,5.71 v12.7,9.53 | v46.35,55.24 45.09,56.52 41.91,56.52 41.62,56.22 IC3.11 | v46.35,22.86 46.35,19.68 45.09,18.41 v45.09,18.44 | 19.05,5.71 20.76,7.43 U$4.TXD | v21.84,5.97 21.59,5.71 19.05,5.71 | v46.33,29.21 46.33,31.77 43.81,34.29 43.18,34.29 41.91,35.56 41.91,38.73 v42.55,39.37
  Bottom 0.152: v14.53,33.77 12.54,31.79 12.54,15.47 12.7,15.32 v12.7,9.53 | v46.35,55.24 46.35,43.18 v42.55,39.37 | v45.09,18.44 43.18,16.53 43.18,15.24 33.02,5.08 22.73,5.08 v21.84,5.97 | v46.35,22.86 46.35,23.81 46.38,23.84 46.38,29.16 v46.33,29.21
TXD-RS485  (via drill 0.35)
  Top 0.152: IC6.16 38.73,20.32 46.99,28.57 46.99,28.86 47.04,28.92 47.04,29.5 46.99,29.56 IC5.4
  Bottom 0.152: IC6.40 29.77,19.27 IC6.16
  other vias: 29.77,15.77 28.71,20.32
VCC  (via drill 0.35)
  Top 1.016: F1.2 43.62,63.06 v43.81,62.87
  Bottom 1.016: JP1.2 28.57,69.22 33.66,64.14 v43.81,64.14 | v43.81,62.87 v43.81,64.14 | v43.81,64.14 46.35,64.14 JP3.2
VCC-EXT
  Bottom 1.016: JP1.3 26.04,66.67 34.29,58.42 48.26,58.42 48.9,58.42 | JP3.3 48.9,58.42 | K1.1 51.3,58.42 48.9,58.42 | J3.1 54.61,44.45 49.53,49.53 48.9,50.16 48.9,58.42
WTD  (via drill 0.35)
  Top 0.152: IC6.26 25.95,32.47 26.59,31.82 28.97,31.82 31.58,29.21 v39.37,29.21 | v40.64,26.67 v43.18,26.67 | IC2.4 45.39,23.85 v45.67,24.13 46.35,24.13 47.2,23.28 R21.1
  Bottom 0.152: v39.37,29.21 40.64,27.94 v40.64,26.67 | v43.18,26.67 45.67,24.18 v45.67,24.13
Y-LED  (via drill 0.35)
  Top 0.152: v13.99,50.15 14.59,50.15 14.86,50.42 IC4.3
  Bottom 0.152: v13.99,50.15 7.62,56.52 3.68,56.52 J2.Y+

### Text on the board
bPlace: Serial Number
tNames: JP1 (POWER INPUT) / 1-2 EXT > BOARD / 2-3 JACK > BOARD | JP3 (POWER OUTPUT) / 1-2 BOARD > EXT / 2-3 NULL | 5V...36V @ 1A | 1 | 2 | 3 | CENTER + | 3 | 2 | 1 | +3V3 | K1 RS-232 | RESET | CONFIG | RS-485 | JTAG | GATEWAY rev2 | 09/18 | AFA & PM
bNames: K1 (RS232) / 1- VCC-EXT / 2- GND / 3- TX / 4- RX | J3 (RS485) / 1- VCC-EXT / 2- GND / 3- A / 4- B